# EAGLE design Baseboard_Buttons (EAGLE 9.5.2)
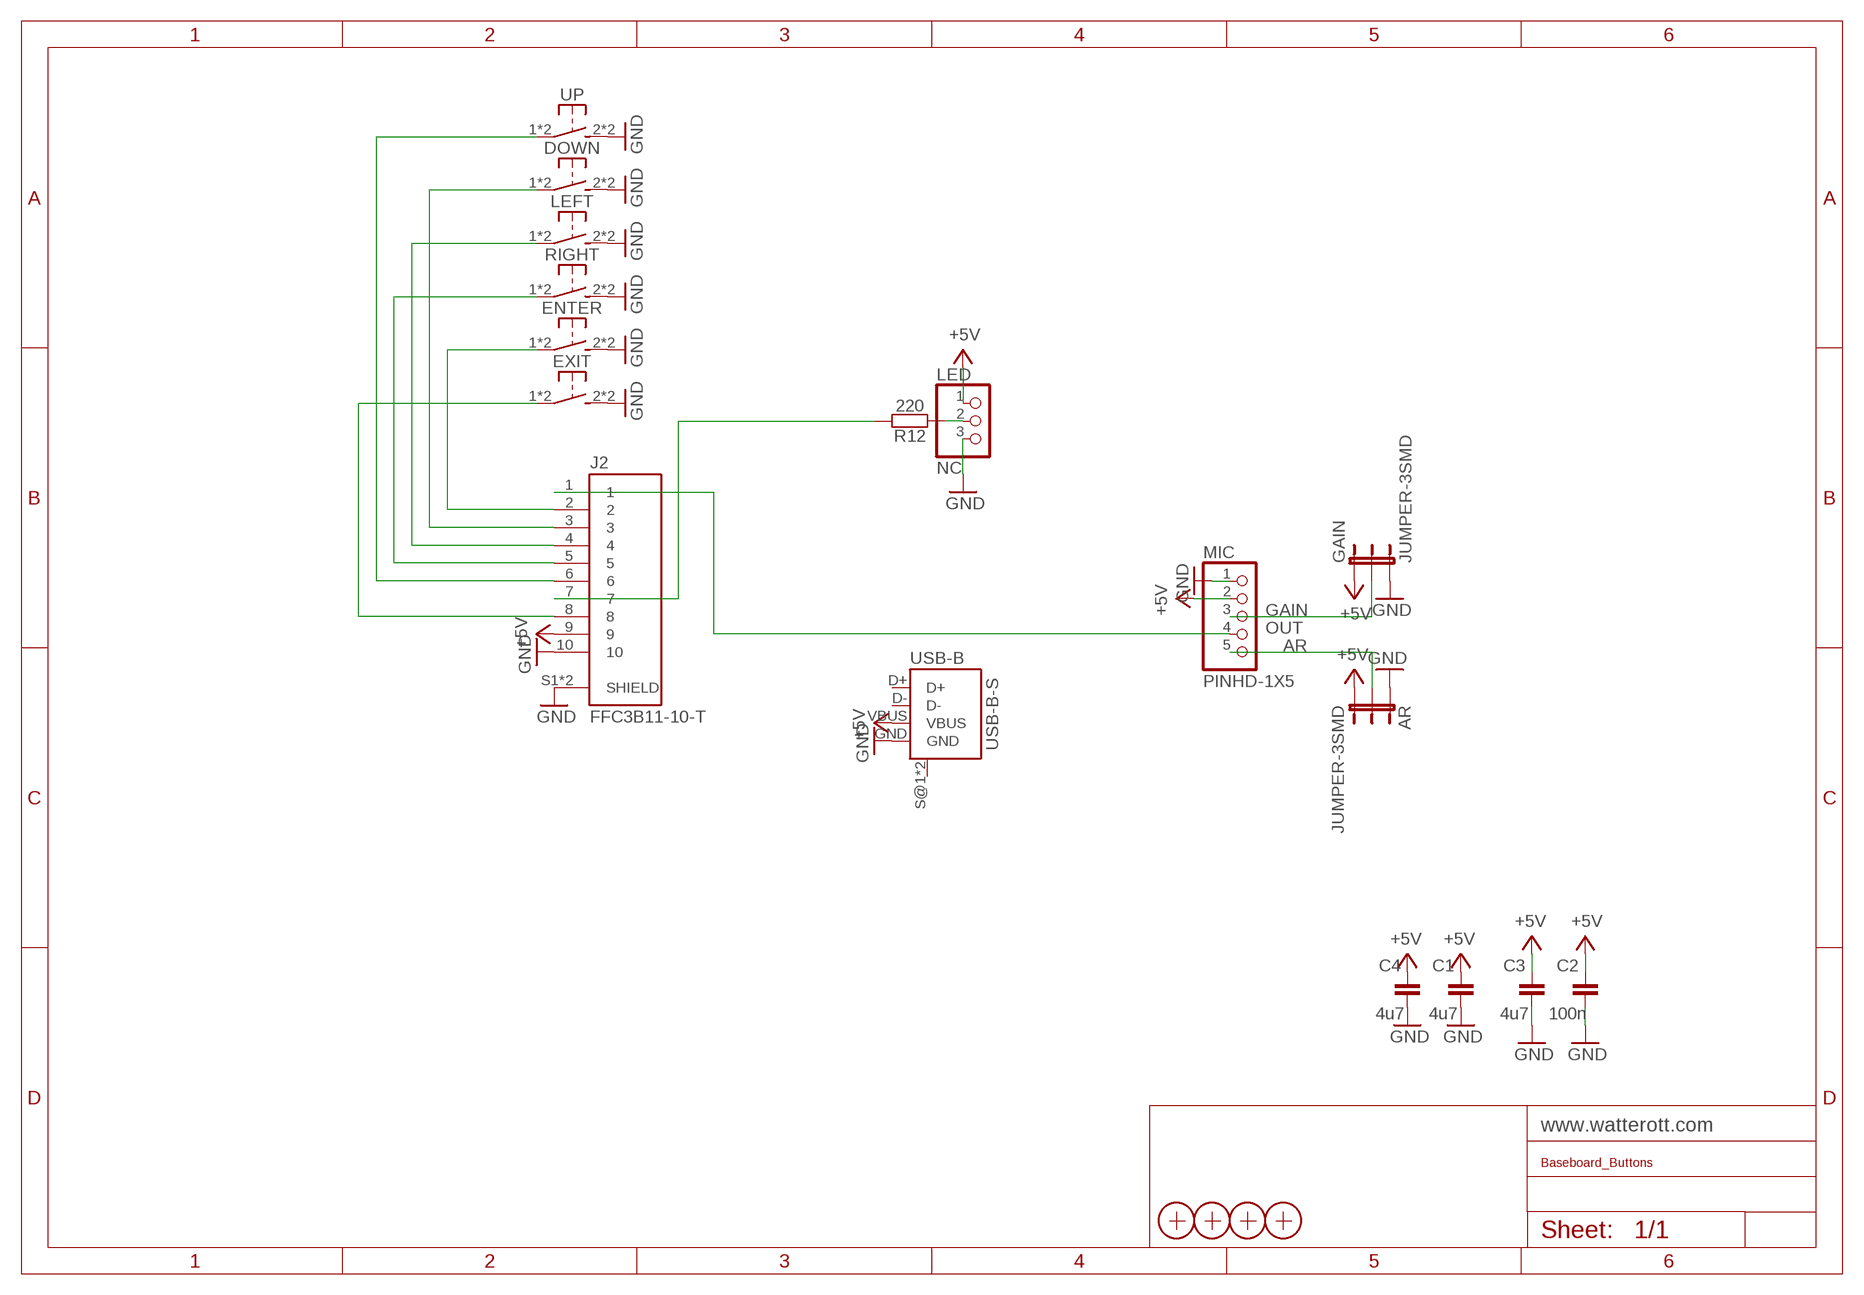
[diagram p0: schematic, sheet 1]

## Parts
AR  JUMPER-3SMD  [SJ_3]
C1  4u7  CAPACITOR-0805  [C0805]
C2  100n  CAPACITOR-0805  [C0805]
C3  4u7  CAPACITOR-0805  [C0805]
C4  4u7  CAPACITOR-0805  [C0805]
DOWN  SW-TACTILE-TL3305  [TL3305]
ENTER  SW-TACTILE-TL3305  [TL3305]
EXIT  SW-TACTILE-TL3305  [TL3305]
GAIN  JUMPER-3SMD  [SJ_3]
J2  FFC3B11-10-T  [GCT_FFC3B11-10-T]
LED  NC  PINHD-1X3  [1X03]
LEFT  SW-TACTILE-TL3305  [TL3305]
MIC  PINHD-1X5  [1X05]
R12  220  RESISTOR-0805  [C0805]
RIGHT  SW-TACTILE-TL3305  [TL3305]
UP  SW-TACTILE-TL3305  [TL3305]
USB-B  USB-B-S  [USB-B-S]
X1  PASSER-07  [PASSER_07MM]
X2  PASSER-07  [PASSER_07MM]
X3  PASSER-07  [PASSER_07MM]
X4  PASSER-07  [PASSER_07MM]

## Nets
+5V: AR.3 C1.2 C2.2 C3.2 C4.2 GAIN.1 J2.9 LED.1 MIC.2 USB-B.VBUS
AR: AR.2 MIC.5
GAIN: GAIN.2 MIC.3
GND: AR.1 C1.1 C2.1 C3.1 C4.1 DOWN.2(S1) DOWN.3(S1) ENTER.2(S1) ENTER.3(S1) EXIT.2(S1) EXIT.3(S1) GAIN.3 J2.10 J2.S1(SHIELD) J2.S2(SHIELD) LED.3 LEFT.2(S1) LEFT.3(S1) MIC.1 RIGHT.2(S1) RIGHT.3(S1) UP.2(S1) UP.3(S1) USB-B.GND
N$2: EXIT.1 EXIT.4(P1) J2.8
N$4: J2.4 LEFT.1 LEFT.4(P1)
N$9: J2.6 UP.1 UP.4(P1)
N$12: DOWN.1 DOWN.4(P1) J2.3
N$13: J2.5 RIGHT.1 RIGHT.4(P1)
N$14: ENTER.1 ENTER.4(P1) J2.2
N$15: J2.7 R12.2
N$16: LED.2 R12.1
OUT: J2.1 MIC.4
Unconnected: USB-B.D+ USB-B.D- USB-B.S@1(SHIELD) USB-B.S@2(SHIELD)

## Library data of the parts
AR GAIN = SparkFun-Retired:JUMPER-3
C1-C4 = we-rcl:CAPACITOR: Capacitor ...2.2uF @ 6.3V -> 0402 ...4.7uF @ 6.3V -> 0603 ...10uF @ 16V -> 0805 ...22uF @ 25V -> 1206
DOWN ENTER EXIT LEFT RIGHT UP = we-switch:SW-TACTILE: Tactile Switche
J2 = FFC3B11-10-T:FFC3B11-10-T: FPC 1.0mm Pitch, Side entry, Top contact, SMT, Height 2.5mm, Slide type Check availability <https://pricing.snapeda.com/parts/FFC3B11-10-T/Global%20Connector%20Technology/view-part?ref=eda>; AVAILABILITY: In Stock; DESCRIPTION: 10 Position FFC, FPC Connector Contacts, Top 0.039 (1.00mm) Surface Mount, Right Angle; MF: Global Connector Technology; MP: FFC3B11-10-T; PACKAGE: None; PRICE: None; PURCHASE-URL: https://pricing.snapeda.com/search/part/FFC3B11-10-T/?ref=eda
LED = Connector:PINHD-1X3: PIN HEADER; CATEGORY: CONNECTOR; SUB-CATEGORY: PIN-HEADER
MIC = Connector:PINHD-1X5: PIN HEADER; CATEGORY: CONNECTOR; SUB-CATEGORY: PIN-HEADER
R12 = we-rcl:RESISTOR: Resistor all kinds in 0402 and 0603
USB-B = we-con:USB: USB Connector
X1-X4 = we-symbol:PASSER: Fiducial Marker

## Board
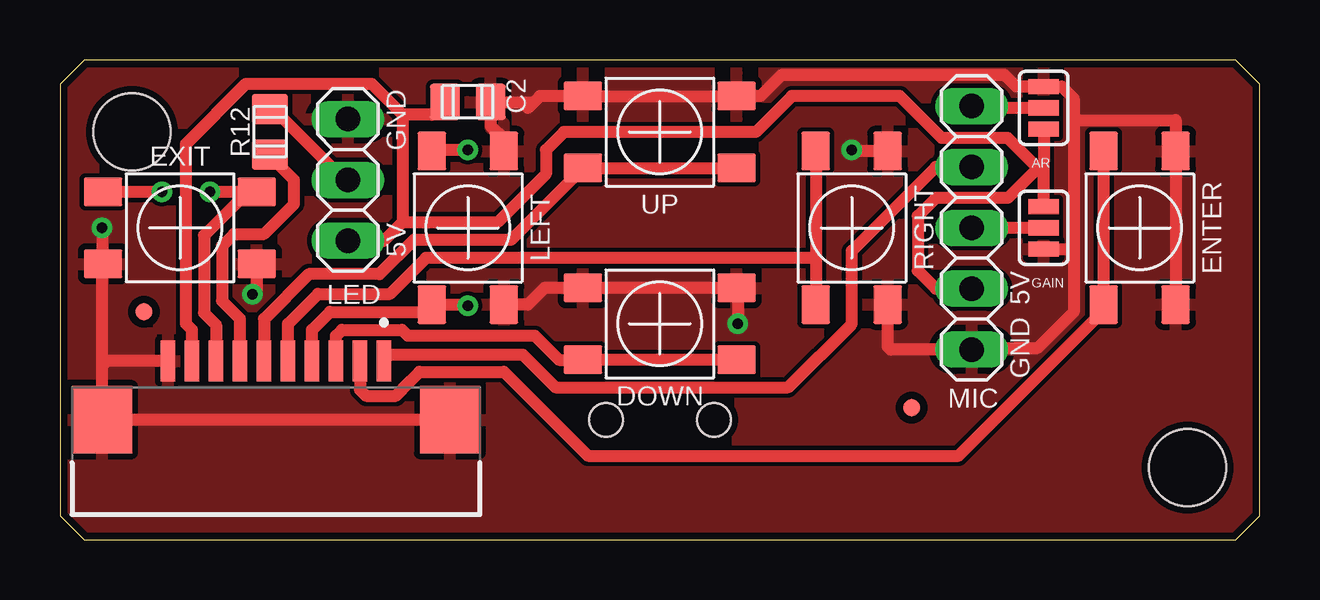
[diagram p1: board, top side]
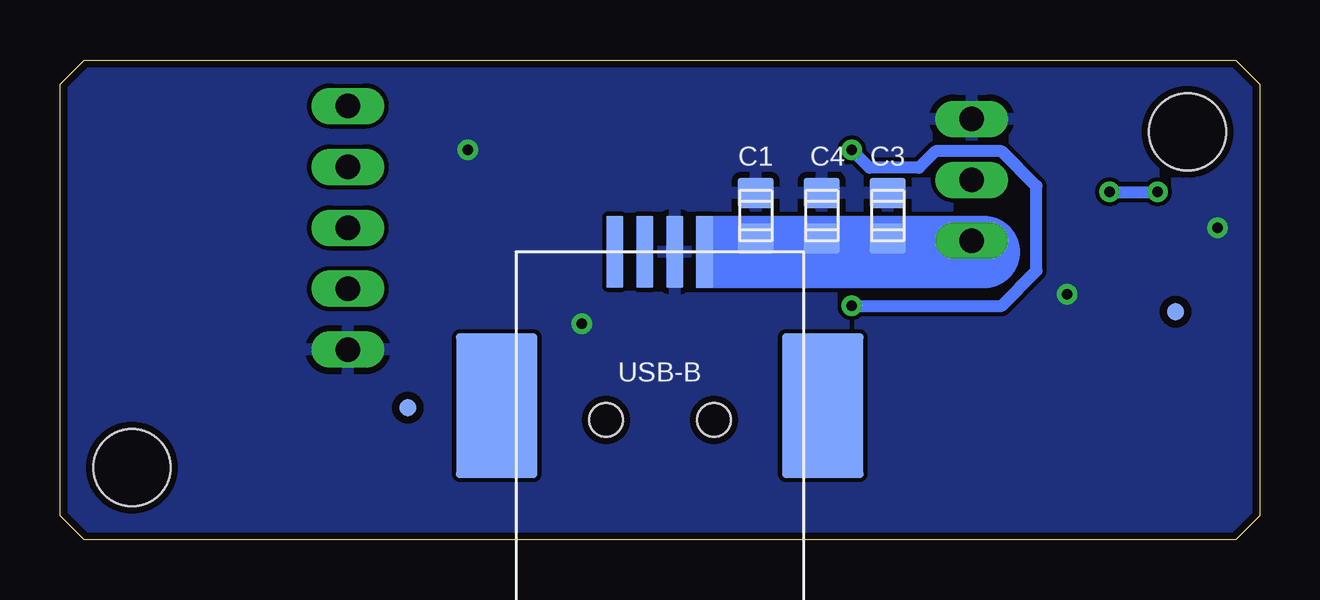
[diagram p2: board, bottom side, seen from below]

Size 50 x 20 mm. Coordinates in mm from the lower left corner, seen from the top.
Outline: 0,1 1,0 49,0 50,1 50,19 49,20 1,20 0,19 0,1
Copper layers (1*16): Top 0.035mm / dielectric 1.5mm / Bottom 0.035mm
Design rules "aisler_2_layer_simple": minimum track width 0.2mm, minimum drill 0.45mm, track to track 0.175mm, track to pad 0.175mm, pad to pad 0.175mm, via to via 0.175mm, smd to smd 0.175mm, copper to edge 0.3mm, drill to drill 0.25mm, minimum pad ring 0.2mm, minimum via ring 0.2mm, stop-mask expansion 0mil, vias tented up to drill 0mil, thermal gap 10mil
Holes 3.2 mm at 3,17 47,3

### Footprints (pad centres in the part's own frame; a part is rotated, then mirrored left to right if it is on the bottom)
SJ_3 = smd 0.635 x 1.27: 1 -0.889,0; 2 0,0; 3 0.889,0
C0805 = smd 1.5 x 1.25: 1 0,0.95; 2 0,-0.95
TL3305 = smd 1.6 x 1.2: 1 -3.2,1.5; 2 -3.2,-1.5; 3 3.2,-1.5; 4 3.2,1.5
GCT_FFC3B11-10-T = smd 0.6 x 1.7: 1 4.5,2.45; 2 3.5,2.45; 3 2.5,2.45; 4 1.5,2.45; 5 0.5,2.45; 6 -0.5,2.45; 7 -1.5,2.45; 8 -2.5,2.45; 9 -3.5,2.45; 10 -4.5,2.45 | smd 2.5 x 2.8: S1 7.25,0; S2 -7.25,0
1X03 = drill 1.016 long: 1 -2.54,0; 2 0,0; 3 2.54,0
1X05 = drill 1.016 long: 1 -5.08,0; 2 -2.54,0; 3 0,0; 4 2.54,0; 5 5.08,0
USB-B-S = smd 3 x 0.7: D+ -7,-1.875; D- -7,-0.625; GND -7,0.625; VBUS -7,1.875 | smd 6.04 x 3.4: S@1 -0.58,6.8; S@2 -0.58,-6.8 | hole 1.4: 0,-2.25; 0,2.25
PASSER_07MM = smd 0.7 x 0.7: X 0,0

### Placement (x,y rotation side)
AR  41,18 270 top
C1  21,13.5 0 bottom
C2  17,18.25 270 top
C3  15.5,13.5 0 bottom
C4  18.25,13.5 0 bottom
DOWN  25,9 180 top
ENTER  45,13 90 top
EXIT  5,13 0 top
GAIN  41,13 270 top
J2  9,5 0 top
LED  12,15 90 top
LEFT  17,13 90 top
MIC  38,13 90 top
R12  8.75,17 0 top
RIGHT  33,13 90 top
UP  25,17 180 top
USB-B  25,5 270 bottom
X1  3.5,9.5 180 bottom
X2  35.5,5.5 180 bottom
X3  3.5,9.5 0 top
X4  35.5,5.5 0 top

### Tracks (layer width: path | path; a pad name or v marks a point on that pad's centre or on a via)
+5V
  Top 0.508: AR.3 41,15.75 | GAIN.1 41,15.75 | 41,15.75 40.75,15.5 | 40.75,15.5 39.5,14.25 36.5,14.25 35.75,13.5 35.75,11.21 36.5,10.46 MIC.2 | 40.75,15.5 39.5,16.75 36.75,16.75 35,18.5 30.5,18.5 29,17 21,17 20.25,16.25 20.25,15.25 18.25,13.25 14.29,13.25 | 14.29,13.25 13.5,12.46 LED.1 | J2.9 5.5,8.75 5.25,9 5.25,16.5 7.76,19.01 12.99,19.01 14.29,17.71 | 14.29,17.71 14.29,13.25 | C2.2 15.51,17.71 14.29,17.71
  Bottom 0.508: USB-B.VBUS 21,12 | 21,12 18.25,12 | 18.25,12 15.5,12 | 15.5,12 12.46,12 LED.1 | C1.2 21,12 | C4.2 18.25,12 | C3.2 15.5,12
AR
  Top 0.508: AR.2 38.08,18 MIC.5
GAIN
  Top 0.508: GAIN.2 MIC.3
GND  (via drill 0.45)
  Top 0.5: UP.3 20,18.5 19.75,18.25 | 19.75,18.25 19.5,18 | C2.1 19.75,18.25
  Top 0.508: LEFT.2 19.5,9.8 20.2,10.5 DOWN.3 DOWN.2 28.25,10.45 v28.25,9 | ENTER.2 ENTER.3 46.5,17.5 42.25,17.5 | GAIN.3 42.11,12.11 | 42.11,12.11 42.25,12.25 | 42.25,17.5 42.25,18.39 41.75,18.89 AR.1 39.86,18.89 39.38,19.38 30.07,19.38 29.2,18.5 UP.2 UP.3 | 42.25,17.5 42.25,12.25 | 42.25,11.97 42.25,9.5 40.75,8 38.08,8 MIC.1 34.63,7.92 34.5,8.05 RIGHT.2 | 42.25,11.97 42.11,12.11 | 42.25,12.25 42.25,11.97 | J2.S1 J2.S2 1.75,7.25 | 1.75,7.25 1.75,11.1 1.8,11.15 EXIT.2 1.75,11.55 v1.75,13 | J2.10 1.95,7.45 1.75,7.25 | 18.5,16.68 LEFT.3 18.5,16.7 17.95,17.25 C2.1 | v8.03,10.22 8.2,10.4 EXIT.3 | RIGHT.3 33.05,16.2 v33,16.25
  pour Bottom: 0,20 50,20 50,0 0,0
  pour Top: 0,20 0,0 50,0 50,20
N$2  (via drill 0.45)
  Top 0.508: J2.8 6.5,8.95 6,9.45 6,12.68 7.82,14.5 EXIT.4 v6.25,14.5 | v4.25,14.5 EXIT.1
  Bottom 0.508: v6.25,14.5 v4.25,14.5
N$4  (via drill 0.45)
  Top 0.508: J2.4 10.5,8.75 11.25,9.5 15.2,9.5 LEFT.1 16.95,9.8 v17,9.75 | v17,16.25 15.55,16.25 LEFT.4
  Bottom 0.508: v17,9.75 10.75,9.75 9.3,11.2 9.3,14.74 10.74,16.19 13.51,16.19 14.19,15.5 16.25,15.5 v17,16.25
N$9
  Top 0.508: UP.1 UP.4 18.8,12.5 14.75,12.5 13.32,11.07 10.37,11.07 8.5,9.2 J2.6
N$12
  Top 0.508: J2.3 11.5,8.5 11.75,8.75 14.25,8.75 14.5,8.5 19.8,8.5 20.8,7.5 DOWN.4 DOWN.1
N$13
  Top 0.508: J2.5 9.5,9 10.75,10.25 13.75,10.25 15.25,11.75 31.5,11.75 RIGHT.4 RIGHT.1
N$14
  Top 0.508: J2.2 12.5,6.25 12.75,6 14,6 14.57,6.57 14.57,6.58 14.99,7 18.5,7 22,3.5 37.45,3.5 43.5,9.55 ENTER.1 ENTER.4
N$15
  Top 0.508: J2.7 7.5,9.2 6.75,9.95 6.75,12.25 7.25,12.75 8.5,12.75 9.75,14 9.75,15 8.75,16 R12.2
N$16
  Top 0.508: LED.2 11.86,15 8.91,17.95 R12.1
OUT
  Top 0.508: J2.1 13.5,7.7 19.3,7.7 20.65,6.35 30.35,6.35 33,9 33,12.04 36.5,15.54 MIC.4
(copper drawn outside any net)
  shapes: Bottom area x1, Bottom circle x1

### Text on the board
tNames: GND | 5V | 5V | GND | MIC